# Altium schematic sheet ECG.SchDoc
size C; DocumentNumber: 2; SheetNumber: 2; SheetTotal: 4
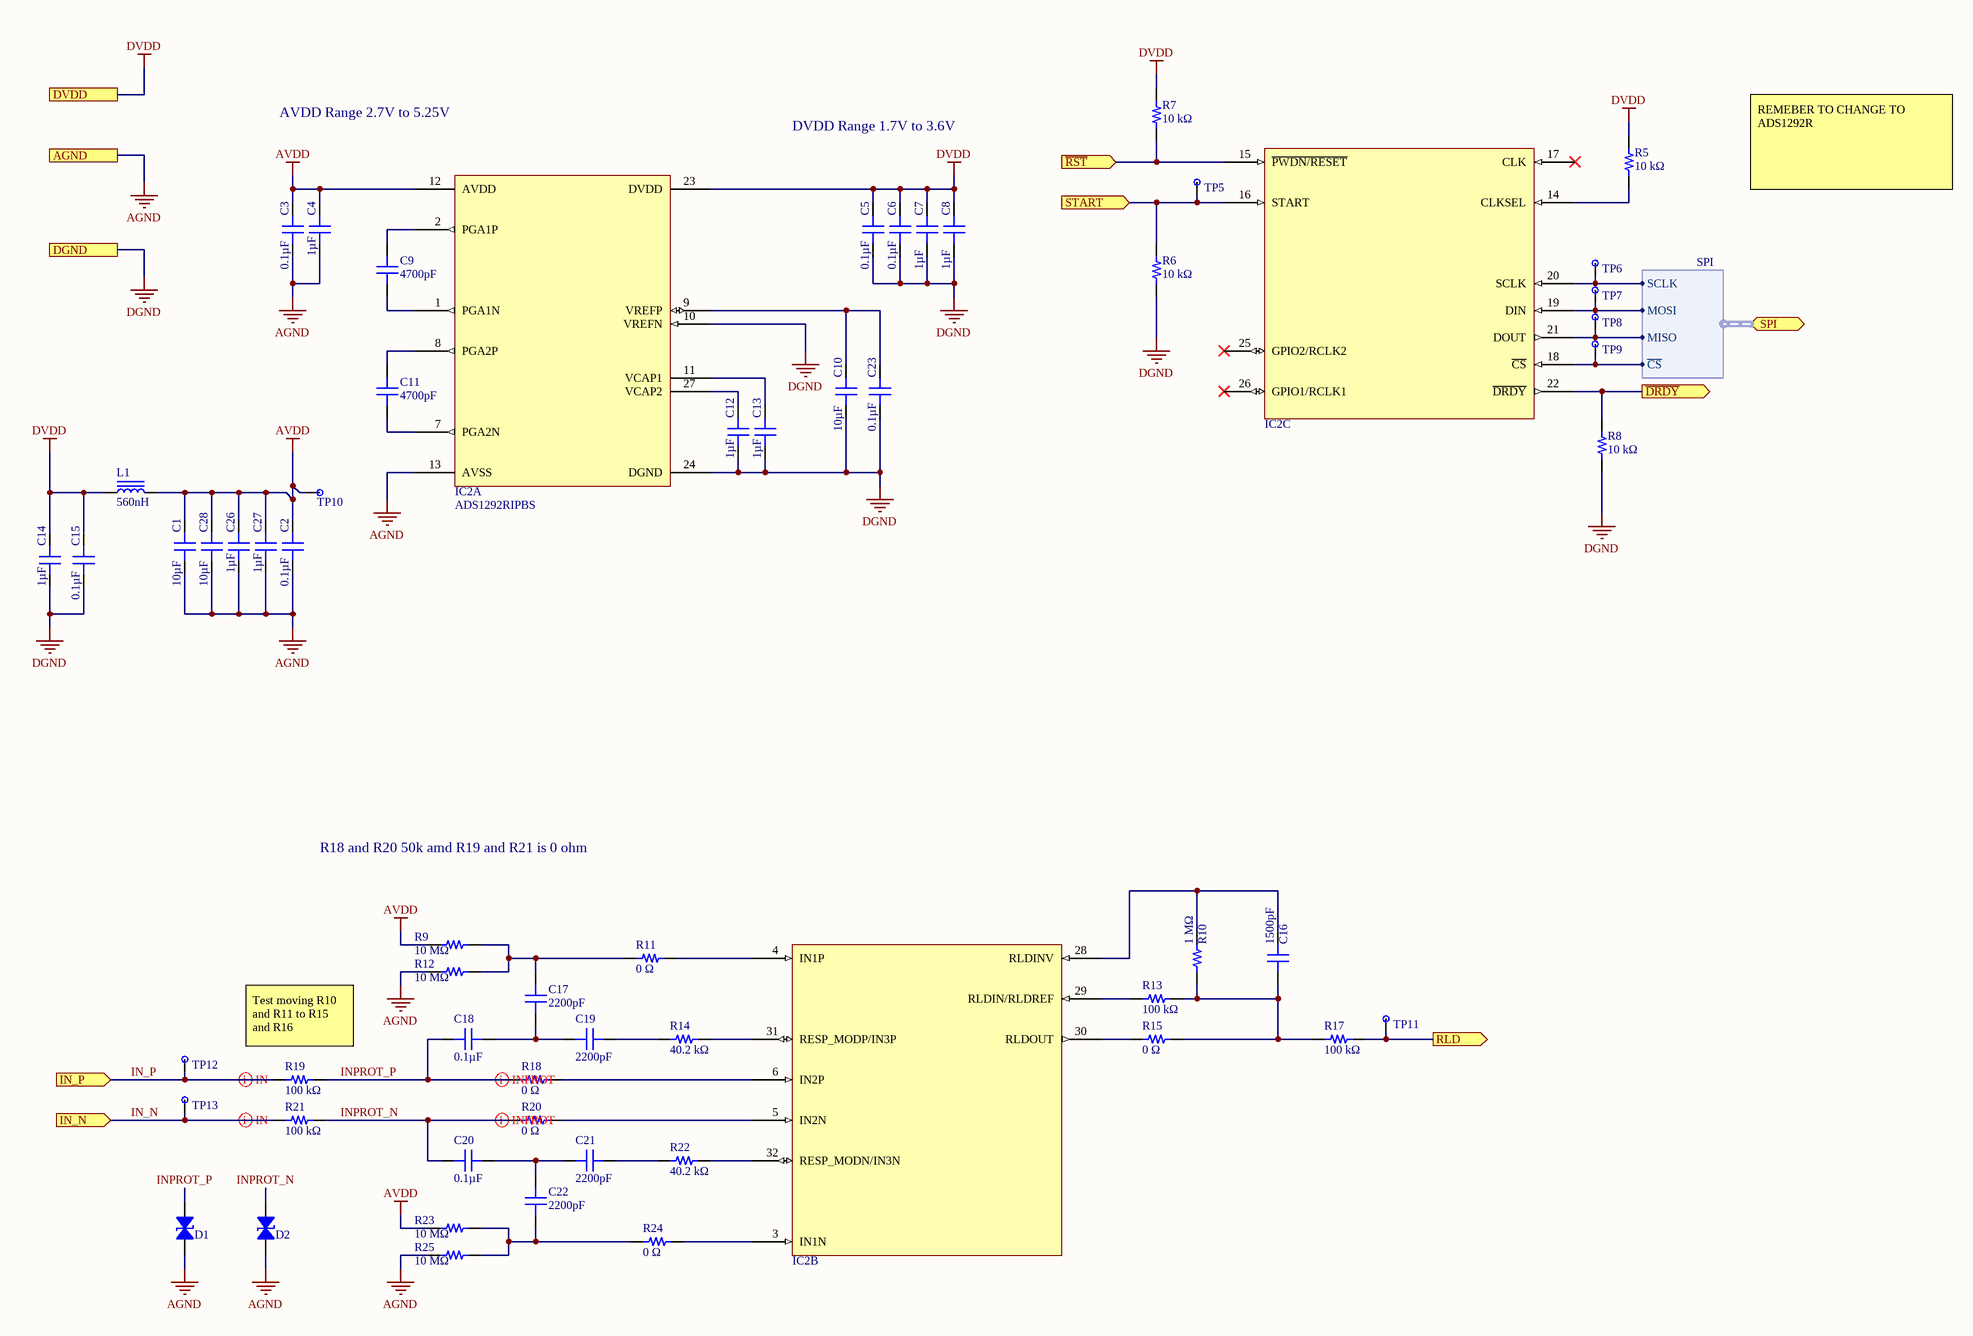
[diagram p0: ECG.SchDoc]

## Parts
C1  10µF  [CAP 0402_1005]
C2  0.1µF  [CAP 0402_1005]
C3  0.1µF  [CAP 0402_1005]
C4  1µF  [CAP 0402_1005]
C5  0.1µF  [CAP 0402_1005]
C6  0.1µF  [CAP 0402_1005]
C7  1µF  [CAP 0402_1005]
C8  1µF  [CAP 0402_1005]
C9  4700pF  [CAP 0402_1005]
C10  10µF  [CAP 0402_1005]
C11  4700pF  [CAP 0402_1005]
C12  1µF  [CAP 0402_1005]
C13  1µF  [CAP 0402_1005]
C14  1µF  [CAP 0402_1005]
C15  0.1µF  [CAP 0402_1005]
C16  1500pF  [CAP 0402_1005]
C17  2200pF  [CAP 0402_1005]
C18  0.1µF  [CAP 0402_1005]
C19  2200pF  [CAP 0402_1005]
C20  0.1µF  [CAP 0402_1005]
C21  2200pF  [CAP 0402_1005]
C22  2200pF  [CAP 0402_1005]
C23  0.1µF  [CAP 0402_1005]
C26  1µF  [CAP 0402_1005]
C27  1µF  [CAP 0402_1005]
C28  10µF  [CAP 0402_1005]
D1  PESD5V0X1BT,215  [DIODES SOT-23-3]  (value not drawn)
D2  PESD5V0X1BT,215  [DIODES SOT-23-3]  (value not drawn)
IC2  ADS1292RIPBS  [TI PQFP-32 5X5MM]  (parts A,B,C of 3)
L1  560nH  [IND 0402_1005]
R5  10 kΩ  [RES 0402_1005]
R6  10 kΩ  [RES 0402_1005]
R7  10 kΩ  [RES 0402_1005]
R8  10 kΩ  [RES 0402_1005]
R9  10 MΩ  [RES 0402_1005]
R10  1 MΩ  [RES 0402_1005]
R11  0 Ω  [RES 0402_1005]
R12  10 MΩ  [RES 0402_1005]
R13  100 kΩ  [RES 0402_1005]
R14  40.2 kΩ  [RES 0402_1005]
R15  0 Ω  [RES 0402_1005]
R17  100 kΩ  [RES 0402_1005]
R18  0 Ω  [RES 0402_1005]
R19  100 kΩ  [RES 0402_1005]
R20  0 Ω  [RES 0402_1005]
R21  100 kΩ  [RES 0402_1005]
R22  40.2 kΩ  [RES 0402_1005]
R23  10 MΩ  [RES 0402_1005]
R24  0 Ω  [RES 0402_1005]
R25  10 MΩ  [RES 0402_1005]
TP5  TP1MM  [Test Point 1MM]  (value not drawn)  (no BOM)
TP6  TP1MM  [Test Point 1MM]  (value not drawn)  (no BOM)
TP7  TP1MM  [Test Point 1MM]  (value not drawn)  (no BOM)
TP8  TP1MM  [Test Point 1MM]  (value not drawn)  (no BOM)
TP9  TP1MM  [Test Point 1MM]  (value not drawn)  (no BOM)
TP10  TP2MM  [Test Point 2MM]  (value not drawn)  (no BOM)
TP11  TP1MM  [Test Point 1MM]  (value not drawn)  (no BOM)
TP12  TP1MM  [Test Point 1MM]  (value not drawn)  (no BOM)
TP13  TP1MM  [Test Point 1MM]  (value not drawn)  (no BOM)

## Ports
AGND, DGND, DVDD, IN_N (in), IN_P (in), RLD (out), SPI (bidir, harness SPI), START (in), ~{DRDY} (out), ~{RST} (in)

## Harnesses
SPI: SCLK, MOSI, MISO, ~{CS}

## Nets
AGND: C1.2 C2.2 C3.2 C4.2 C26.2 C27.2 C28.2 D1.1 D2.1 IC2.13(AVSS) R12.1 R25.1 ; port AGND
AVDD: C1.1 C2.1 C3.1 C4.1 C26.1 C27.1 C28.1 IC2.12(AVDD) L1.2 R9.1 R23.1 TP10.1
DGND: C5.2 C6.2 C7.2 C8.2 C10.2 C12.2 C13.2 C14.2 C15.2 C23.2 IC2.10(VREFN) IC2.24(DGND) R6.2 R8.2 ; port DGND
DVDD: C5.1 C6.1 C7.1 C8.1 C14.1 C15.1 IC2.23(DVDD) L1.1 R5.1 R7.1 ; port DVDD
~{DRDY}: IC2.22(~{DRDY}) R8.1 ; port ~{DRDY}
IN_N: R21.2 TP13.1 ; port IN_N
IN_P: R19.2 TP12.1 ; port IN_P
INPROT_N: C20.2 D2.2 R20.2 R21.1
INPROT_P: C18.2 D1.2 R18.2 R19.1
~{RST}: IC2.15(~{PWDN/RESET}) R7.2 ; port ~{RST}
RLD: R17.1 TP11.1 ; port RLD
START: IC2.16(START) R6.1 TP5.1 ; port START
NetC9_1: C9.1 IC2.2(PGA1P)
NetC9_2: C9.2 IC2.1(PGA1N)
NetC10_1: C10.1 C23.1 IC2.9(VREFP)
NetC11_1: C11.1 IC2.8(PGA2P)
NetC11_2: C11.2 IC2.7(PGA2N)
NetC12_1: C12.1 IC2.27(VCAP2)
NetC13_1: C13.1 IC2.11(VCAP1)
NetC16_1: C16.1 IC2.28(RLDINV) R10.1
NetC16_2: C16.2 R10.2 R13.2 R15.1 R17.2
NetC17_1: C17.1 R9.2 R11.2 R12.2
NetC17_2: C17.2 C18.1 C19.2
NetC19_1: C19.1 R14.2
NetC20_1: C20.1 C21.2 C22.1
NetC21_1: C21.1 R22.2
NetC22_2: C22.2 R23.2 R24.2 R25.2
NetIC2_3: IC2.3(IN1N) R24.1
NetIC2_4: IC2.4(IN1P) R11.1
NetIC2_5: IC2.5(IN2N) R20.1
NetIC2_6: IC2.6(IN2P) R18.1
NetIC2_14: IC2.14(CLKSEL) R5.2
NetIC2_18: IC2.18(~{CS}) TP9.1 ; port SPI.~{CS}
NetIC2_19: IC2.19(DIN) TP7.1 ; port SPI.MOSI
NetIC2_20: IC2.20(SCLK) TP6.1 ; port SPI.SCLK
NetIC2_21: IC2.21(DOUT) TP8.1 ; port SPI.MISO
NetIC2_29: IC2.29(RLDIN/RLDREF) R13.1
NetIC2_30: IC2.30(RLDOUT) R15.2
NetIC2_31: IC2.31(RESP_MODP/IN3P) R14.1
NetIC2_32: IC2.32(RESP_MODN/IN3N) R22.1

Not connected (* = marked no-connect by the designer): IC2 17(CLK)* 25(GPIO2/RCLK2)* 26(GPIO1/RCLK1)*

## Layout directives
differential pair: IN_N, IN_P, INPROT_N, INPROT_P

## Notes on the sheet
- AVDD Range 2.7V to 5.25V
- DVDD Range 1.7V to 3.6V
- REMEBER TO CHANGE TO ADS1292R
- R18 and R20 50k amd R19 and R21 is 0 ohm
- (near R19) Test moving R10 and R11 to R15 and R16

## Library data of the parts
C1 C10 C28 = 0402ZD106MAT2A: CAP CER 10UF 10V X5R 0402; Manufacturer: AVX Corporation; Tolerance: ±20%; Part Number: 0402ZD106MAT2A; Applications: General Purpose; Capacitance: 10µF; ComponentLink1Description: Datasheet; ComponentLink1URL: http://datasheets.avx.com/cx5r.pdf; ComponentLink2Description: DigiKey Link; ComponentLink2URL: http://digikey.com/product-detail/en/avx-corporation/0402ZD106MAT2A/478-10052-1-ND/6564275; Device Package: 0402 (1005 Metric); LastUpdated: 2020-02-03 5:04:16 PM; Lifecycle Status: Active; Minimum Order: 1; Mounting Type: Surface Mount, MLCC; Operating Temperature: -55°C ~ 85°C; Package / Case: 0402 (1005 Metric); Packaging: TapeAndReel; Part Status: Active; Price: 0.24; Series: -; Size / Dimension: 0.039" L x 0.020" W (1.00mm x 0.50mm); Supplier 1: DigiKey; Supplier Part Number 1: 478-10052-1-ND; Temperature Coefficient: X5R; Thickness (Max): 0.028" (0.71mm); Value: 10µF; Voltage - Rated: 10V
C2 C3 C5 C6 C15 C23 = 04023C104JAT2A: CAP CER 0.1UF 25V X7R 0402; Manufacturer: AVX Corporation; Tolerance: ±5%; Part Number: 04023C104JAT2A; Applications: General Purpose; Capacitance: 0.1µF; ComponentLink1Description: Datasheet; ComponentLink1URL: http://datasheets.avx.com/X7RDielectric.pdf; ComponentLink2Description: DigiKey Link; ComponentLink2URL: http://digikey.com/product-detail/en/avx-corporation/04023C104JAT2A/478-10050-1-ND/6564273; Device Package: 0402 (1005 Metric); LastUpdated: 2020-02-03 5:03:51 PM; Lifecycle Status: Active; Minimum Order: 1; Mounting Type: Surface Mount, MLCC; Operating Temperature: -55°C ~ 125°C; Package / Case: 0402 (1005 Metric); Packaging: CutTape; Part Status: Active; Price: 0.14; Series: -; Size / Dimension: 0.039" L x 0.020" W (1.00mm x 0.50mm); Supplier 1: DigiKey; Supplier Part Number 1: 478-10050-1-ND; Temperature Coefficient: X7R; Thickness (Max): 0.022" (0.56mm); Value: 0.1µF; Voltage - Rated: 25V
C4 C7 C8 C12-C14 C26 C27 = 0402ZD105KAT2A: CAP CER 1UF 10V X5R 0402; Manufacturer: AVX Corporation; Tolerance: ±10%; Part Number: 0402ZD105KAT2A; Applications: General Purpose; Capacitance: 1µF; ComponentLink1Description: Datasheet; ComponentLink1URL: http://datasheets.avx.com/cx5r.pdf; ComponentLink2Description: DigiKey Link; ComponentLink2URL: http://digikey.com/product-detail/en/avx-corporation/0402ZD105KAT2A/478-4596-1-ND/1645907; Device Package: 0402 (1005 Metric); LastUpdated: 2020-02-03 5:04:20 PM; Lifecycle Status: Active; Minimum Order: 1; Mounting Type: Surface Mount, MLCC; Operating Temperature: -55°C ~ 85°C; Package / Case: 0402 (1005 Metric); Packaging: TapeAndReel; Part Status: Active; Price: 0.03; Series: -; Size / Dimension: 0.039" L x 0.020" W (1.00mm x 0.50mm); Supplier 1: DigiKey; Supplier Part Number 1: 478-4596-1-ND; Temperature Coefficient: X5R; Thickness (Max): 0.022" (0.56mm); Value: 1µF; Voltage - Rated: 10V
C9 C11 = C0402C472K4RECAUTO: CAP CER 0402 4.7NF 16V X7R 10%; Manufacturer: KEMET; Part Number: C0402C472K4RECAUTO; Applications: Automotive, ESD Protection; Capacitance: 4700pF; ComponentLink1Description: Datasheet; ComponentLink1URL: https://api.kemet.com/component-edge/download/datasheet/C0402C472K4RECAUTO.pdf; ComponentLink2Description: DigiKey Link; ComponentLink2URL: http://digikey.com/product-detail/en/kemet/C0402C472K4RECAUTO/399-17875-1-ND/8640542; Device Package: 0402 (1005 Metric); LastUpdated: 2020-02-03 5:04:46 PM; Lifecycle Status: Active; Minimum Order: 1; Mounting Type: Surface Mount, MLCC; Operating Temperature: -55°C ~ 125°C; Package / Case: 0402 (1005 Metric); Packaging: TapeAndReel; Part Status: Active; Price: 0.02; Ratings: AEC-Q200; Series: ESD SMD Auto X7R; Size / Dimension: 0.039" L x 0.020" W (1.00mm x 0.50mm); Supplier 1: DigiKey; Supplier Part Number 1: 399-17875-1-ND; Temperature Coefficient: X7R; Thickness (Max): 0.022" (0.55mm); Tolerance: ±10%; Value: 4700pF; Voltage - Rated: 16V
C16 = C0402C152K5GECAUTO: CAP CER 0402 1.5NF 50V C0G 10%; Manufacturer: KEMET; Temperature Coefficient: C0G, NP0; Part Number: C0402C152K5GECAUTO; Applications: Automotive, ESD Protection; Capacitance: 1500pF; ComponentLink1Description: Datasheet; ComponentLink1URL: https://api.kemet.com/component-edge/download/datasheet/C0402C152K5GECAUTO.pdf; ComponentLink2Description: DigiKey Link; ComponentLink2URL: http://digikey.com/product-detail/en/kemet/C0402C152K5GECAUTO/399-17901-1-ND/8640568; Device Package: 0402 (1005 Metric); Features: Low ESL; LastUpdated: 2020-02-03 5:04:46 PM; Lifecycle Status: Active; Minimum Order: 1; Mounting Type: Surface Mount, MLCC; Operating Temperature: -55°C ~ 125°C; Package / Case: 0402 (1005 Metric); Packaging: TapeAndReel; Part Status: Active; Price: 0.02; Ratings: AEC-Q200; Series: ESD SMD Auto C0G; Size / Dimension: 0.039" L x 0.020" W (1.00mm x 0.50mm); Supplier 1: DigiKey; Supplier Part Number 1: 399-17901-1-ND; Thickness (Max): 0.022" (0.55mm); Tolerance: ±10%; Value: 1500pF; Voltage - Rated: 50V
C17 C19 C21 C22 = 04023C222JAT2A: CAP CER 2200PF 25V X7R 0402; Manufacturer: AVX Corporation; Tolerance: ±5%; Part Number: 04023C222JAT2A; Applications: General Purpose; Capacitance: 2200pF; ComponentLink1Description: Datasheet; ComponentLink1URL: http://datasheets.avx.com/X7RDielectric.pdf; ComponentLink2Description: DigiKey Link; ComponentLink2URL: http://digikey.com/product-detail/en/avx-corporation/04023C222JAT2A/478-12619-1-ND/9949157; Device Package: 0402 (1005 Metric); LastUpdated: 2020-02-03 5:04:22 PM; Lifecycle Status: Active; Minimum Order: 1; Mounting Type: Surface Mount, MLCC; Operating Temperature: -55°C ~ 125°C; Package / Case: 0402 (1005 Metric); Packaging: TapeAndReel; Part Status: Active; Price: 0.01; Series: -; Size / Dimension: 0.039" L x 0.020" W (1.00mm x 0.50mm); Supplier 1: DigiKey; Supplier Part Number 1: 478-12619-1-ND; Temperature Coefficient: X7R; Thickness (Max): 0.022" (0.56mm); Value: 2200pF; Voltage - Rated: 25V
C18 C20 = 0402B104J160CT: CAP CER 0.1UF 16V X7R 0402; Manufacturer: Walsin Technology Corporation; Tolerance: ±5%; Part Number: 0402B104J160CT; Applications: General Purpose; Capacitance: 0.1µF; ComponentLink1Description: Datasheet; ComponentLink1URL: http://www.passivecomponent.com/wp-content/uploads/2018/10/MLCC.pdf; ComponentLink2Description: DigiKey Link; ComponentLink2URL: http://digikey.com/product-detail/en/walsin-technology-corporation/0402B104J160CT/1292-1174-1-ND/9355178; Device Package: 0402 (1005 Metric); LastUpdated: 2020-02-03 5:04:13 PM; Lifecycle Status: Active; Minimum Order: 1; Mounting Type: Surface Mount, MLCC; Operating Temperature: -55°C ~ 125°C; Package / Case: 0402 (1005 Metric); Packaging: TapeAndReel; Part Status: Active; Price: 0.01; Series: -; Size / Dimension: 0.039" L x 0.020" W (1.00mm x 0.50mm); Supplier 1: DigiKey; Supplier Part Number 1: 1292-1174-1-ND; Temperature Coefficient: X7R; Thickness (Max): 0.022" (0.55mm); Value: 0.1µF; Voltage - Rated: 16V
D1 D2 = PESD5V0X1BT,215: TVS DIODE 5V SOT23; Manufacturer: Nexperia USA Inc.; Bidirectional Channels: 1; Capacitance @ Frequency: 0.9pF @ 1MHz; Power Line Protection: No; Type: Zener; Unidirectional Channels: 2; Voltage - Breakdown (Min): 5.8V; Voltage - Reverse Standoff (Typ): 5V (Max); Part Number: PESD5V0X1BT,215; Applications: Automotive; ComponentLink1Description: Datasheet; ComponentLink1URL: https://assets.nexperia.com/documents/data-sheet/PESD5V0X1BQ_PESD5V0X1BT.pdf; ComponentLink2Description: DigiKey Link; ComponentLink2URL: http://digikey.com/product-detail/en/nexperia-usa-inc/PESD5V0X1BT215/1727-4160-1-ND/1993013; Device Package: TO-236-3, SC-59, SOT-23-3; LastUpdated: 2020-02-03 5:12:31 PM; Lifecycle Status: Active; Minimum Order: 1; Mounting Type: Surface Mount; Operating Temperature: -55°C ~ 150°C (TA); Package / Case: TO-236-3, SC-59, SOT-23-3; Packaging: TapeAndReel; Part Status: Active; Price: 0.08; Series: Automotive, AEC-Q101; Supplier 1: DigiKey; Supplier Part Number 1: 1727-4160-1-ND; Supplier Device Package: TO-236AB
IC2 = ADS1292RIPBS: IC AFE 2 CHAN 24BIT 32TQFP; Manufacturer: Texas Instruments; Number of Bits: 24; Number of Channels: 2; Voltage - Supply, Analog: 2.7V ~ 5.25V; Voltage - Supply, Digital: 1.7V ~ 3.6V; Power (Watts): 740µW; Part Number: ADS1292RIPBS; ComponentLink1Description: Datasheet; ComponentLink1URL: http://www.ti.com/general/docs/suppproductinfo.tsp?distId=10&gotoUrl=http%3A%2F%2Fwww.ti.com%2Flit%2Fgpn%2Fads1292; ComponentLink2Description: DigiKey Link; ComponentLink2URL: https://www.digikey.com/product-detail/en/texas-instruments/ADS1292RIPBS/296-30331-5-ND/3137204; Device Package: 32-TQFP; LastUpdated: 2020-09-04 9:42:30 PM; Lifecycle Status: 1; Minimum Order: 1; Mounting Type: Surface Mount; Package / Case: 32-TQFP; Packaging: 32-TQFP (5x5); Part Status: Active; Price: 10.68; Supplier 1: Digikey; Supplier Part Number 1: 296-30331-5-ND
L1 = MLF1005GR56JT000: FIXED IND 560NH 45MA 470 MOHM; Manufacturer: TDK Corporation; DC Resistance (DCR): 470mOhm Max; Frequency - Self Resonant: 170MHz; Inductance Frequency - Test: 10MHz; Material - Core: Ferrite; Q @ Freq: 30 @ 10MHz; Shielding: Shielded; Tolerance: ±5%; Type: Multilayer; Part Number: MLF1005GR56JT000; ComponentLink1Description: Datasheet; ComponentLink1URL: https://product.tdk.com/info/en/catalog/datasheets/inductor_commercial_standard_mlf1005_en.pdf?ref_disty=digikey; ComponentLink2Description: DigiKey Link; ComponentLink2URL: http://digikey.com/product-detail/en/tdk-corporation/MLF1005GR56JT000/445-15694-1-ND/4327990; Current Rating (Amps): 45mA; Device Package: 0402 (1005 Metric); Height - Seated (Max): 0.022" (0.55mm); Inductance: 560nH; LastUpdated: 2020-02-03 5:15:45 PM; Lifecycle Status: Active; Minimum Order: 1; Mounting Type: Surface Mount; Operating Temperature: -55°C ~ 125°C; Package / Case: 0402 (1005 Metric); Packaging: TapeAndReel; Part Status: Active; Price: 0.10; Series: MLF; Size / Dimension: 0.039" L x 0.020" W (1.00mm x 0.50mm); Supplier 1: DigiKey; Supplier Part Number 1: 445-15694-1-ND; Supplier Device Package: 0402 (1005 Metric); Value: 560nH
R5-R8 = AC0402FR-0710KL: RES SMD 10K OHM 1% 1/16W 0402; Manufacturer: Yageo; Power (Watts): 0.063W, 1/16W; Temperature Coefficient: ±100ppm/°C; Value: 10 kOhms; Part Number: AC0402FR-0710KL; ComponentLink1Description: Datasheet; ComponentLink1URL: https://www.yageo.com/upload/media/product/productsearch/datasheet/rchip/PYu-AC_51_RoHS_L_7.pdf; ComponentLink2Description: DigiKey Link; ComponentLink2URL: http://digikey.com/product-detail/en/yageo/AC0402FR-0710KL/YAG3436CT-ND/6006285; Composition: Thick Film; Device Package: 0402 (1005 Metric); Features: Automotive AEC-Q200, Moisture Resistant; Height - Seated (Max): 0.015" (0.37mm); LastUpdated: 2020-02-19 6:28:05 AM; Lifecycle Status: Active; Minimum Order: 1; Number of Terminations: 2; Operating Temperature: -55°C ~ 155°C; Package / Case: 0402 (1005 Metric); Packaging: CutTape; Part Status: Active; Price: 0.10; Ratings: AEC-Q200; Resistance: 10 kΩ; Series: AC; Size / Dimension: 0.039" L x 0.020" W (1.00mm x 0.50mm); Supplier 1: DigiKey; Supplier Part Number 1: YAG3436CT-ND; Supplier Device Package: 0402; Tolerance: ±1%
R9 R12 R23 R25 = AC0402FR-0710ML: RES SMD 10M OHM 1% 1/16W 0402; Manufacturer: Yageo; Power (Watts): 0.063W, 1/16W; Temperature Coefficient: ±100ppm/°C; Value: 10 MOhms; Part Number: AC0402FR-0710ML; ComponentLink1Description: Datasheet; ComponentLink1URL: https://www.yageo.com/upload/media/product/productsearch/datasheet/rchip/PYu-AC_51_RoHS_L_7.pdf; ComponentLink2Description: DigiKey Link; ComponentLink2URL: http://digikey.com/product-detail/en/yageo/AC0402FR-0710ML/YAG3437CT-ND/6006286; Composition: Thick Film; Device Package: 0402 (1005 Metric); Features: Automotive AEC-Q200, Moisture Resistant; Height - Seated (Max): 0.015" (0.37mm); LastUpdated: 2020-02-19 6:28:05 AM; Lifecycle Status: Active; Minimum Order: 1; Number of Terminations: 2; Operating Temperature: -55°C ~ 155°C; Package / Case: 0402 (1005 Metric); Packaging: CutTape; Part Status: Active; Price: 0.10; Ratings: AEC-Q200; Resistance: 10 MΩ; Series: AC; Size / Dimension: 0.039" L x 0.020" W (1.00mm x 0.50mm); Supplier 1: DigiKey; Supplier Part Number 1: YAG3437CT-ND; Supplier Device Package: 0402; Tolerance: ±1%
R10 = AC0402FR-071ML: RES SMD 1M OHM 1% 1/16W 0402; Manufacturer: Yageo; Power (Watts): 0.063W, 1/16W; Temperature Coefficient: ±100ppm/°C; Value: 1 MOhms; Part Number: AC0402FR-071ML; ComponentLink1Description: Datasheet; ComponentLink1URL: https://www.yageo.com/upload/media/product/productsearch/datasheet/rchip/PYu-AC_51_RoHS_L_7.pdf; ComponentLink2Description: DigiKey Link; ComponentLink2URL: http://digikey.com/product-detail/en/yageo/AC0402FR-071ML/YAG3450CT-ND/6006299; Composition: Thick Film; Device Package: 0402 (1005 Metric); Features: Automotive AEC-Q200, Moisture Resistant; Height - Seated (Max): 0.015" (0.37mm); LastUpdated: 2020-02-19 6:28:05 AM; Lifecycle Status: Active; Minimum Order: 1; Number of Terminations: 2; Operating Temperature: -55°C ~ 155°C; Package / Case: 0402 (1005 Metric); Packaging: CutTape; Part Status: Active; Price: 0.10; Ratings: AEC-Q200; Resistance: 1 MΩ; Series: AC; Size / Dimension: 0.039" L x 0.020" W (1.00mm x 0.50mm); Supplier 1: DigiKey; Supplier Part Number 1: YAG3450CT-ND; Supplier Device Package: 0402; Tolerance: ±1%
R11 R15 R18 R20 R24 = 5112: 0402 JUMPER ON TAPE AND REEL; Part Number: 5112; Manufacturer: Keystone Electronics; Power (Watts): 0.5W, 1/2W; Value: 0 Ohms; ComponentLink1Description: Datasheet; ComponentLink1URL: http://www.keystoneelectronics.net/ENG._DEPT/WEB_ORACLE/PDF/PDF%20CAT%20NO%20DRAWINGS/5000-5999/5112.PDF; ComponentLink2Description: DigiKey Link; ComponentLink2URL: http://digikey.com/product-detail/en/keystone-electronics/5112/36-5112-1-ND/9921855; Composition: Metal Element; Device Package: 0402 (1005 Metric); Height - Seated (Max): 0.020" (0.50mm); LastUpdated: 2020-02-19 6:28:05 AM; Lifecycle Status: Active; Minimum Order: 1; Number of Terminations: 2; Package / Case: 0402 (1005 Metric); Packaging: TapeAndReel; Part Status: Active; Price: 0.19; Resistance: 0 Ω; Series: -; Size / Dimension: 0.039" L x 0.020" W (1.00mm x 0.50mm); Supplier 1: DigiKey; Supplier Part Number 1: 36-5112-1-ND; Supplier Device Package: 0402; Tolerance: Jumper
R13 R17 R19 R21 = AC0402FR-07100KL: RES SMD 100K OHM 1% 1/16W 0402; Manufacturer: Yageo; Power (Watts): 0.063W, 1/16W; Temperature Coefficient: ±100ppm/°C; Value: 100 kOhms; Part Number: AC0402FR-07100KL; ComponentLink1Description: Datasheet; ComponentLink1URL: https://www.yageo.com/upload/media/product/productsearch/datasheet/rchip/PYu-AC_51_RoHS_L_7.pdf; ComponentLink2Description: DigiKey Link; ComponentLink2URL: http://digikey.com/product-detail/en/yageo/AC0402FR-07100KL/YAG3434CT-ND/6006283; Composition: Thick Film; Device Package: 0402 (1005 Metric); Features: Automotive AEC-Q200, Moisture Resistant; Height - Seated (Max): 0.015" (0.37mm); LastUpdated: 2020-02-19 6:28:05 AM; Lifecycle Status: Active; Minimum Order: 1; Number of Terminations: 2; Operating Temperature: -55°C ~ 155°C; Package / Case: 0402 (1005 Metric); Packaging: CutTape; Part Status: Active; Price: 0.10; Ratings: AEC-Q200; Resistance: 100 kΩ; Series: AC; Size / Dimension: 0.039" L x 0.020" W (1.00mm x 0.50mm); Supplier 1: DigiKey; Supplier Part Number 1: YAG3434CT-ND; Supplier Device Package: 0402; Tolerance: ±1%
R14 R22 = AT0402BRD0740K2L: RES SMD 40.2KOHM 0.1% 1/16W 0402; Manufacturer: Yageo; Power (Watts): 0.063W, 1/16W; Temperature Coefficient: ±25ppm/°C; Value: 40.2 kOhms; Part Number: AT0402BRD0740K2L; ComponentLink1Description: Datasheet; ComponentLink1URL: http://www.yageo.com/documents/recent/PYu-AT_51_RoHS_L_5.pdf; ComponentLink2Description: DigiKey Link; ComponentLink2URL: http://digikey.com/product-detail/en/yageo/AT0402BRD0740K2L/YAG2090CT-ND/5139538; Composition: Thin Film; Device Package: 0402 (1005 Metric); Features: Anti-Sulfur, Automotive AEC-Q200, Moisture Resistant; Height - Seated (Max): 0.014" (0.35mm); LastUpdated: 2020-02-19 6:28:05 AM; Lifecycle Status: Active; Minimum Order: 1; Number of Terminations: 2; Operating Temperature: -55°C ~ 155°C; Package / Case: 0402 (1005 Metric); Packaging: TapeAndReel; Part Status: Active; Price: 0.09; Ratings: AEC-Q200; Resistance: 40.2 kΩ; Series: AT; Size / Dimension: 0.039" L x 0.020" W (1.00mm x 0.50mm); Supplier 1: DigiKey; Supplier Part Number 1: YAG2090CT-ND; Supplier Device Package: 0402; Tolerance: ±0.1%
TP5-TP9 TP11-TP13 = TP1MM: 1MM Circular Test Point; Part Number: TP1MM
TP10 = TP2MM: 2MM Circular Test Point; Part Number: TP2MM